# Altium schematic sheet QWIIC.SchDoc: QWIIC
size A3; Author: Silvio Navaretti; CompanyName: ARDUINO; DrawnBy: Silvio Navaretti; Engineer: Silvio Navaretti; Organization: ARDUINO; SheetNumber: 13; SheetTotal: 51; RevAuthor: Silvio Navaretti
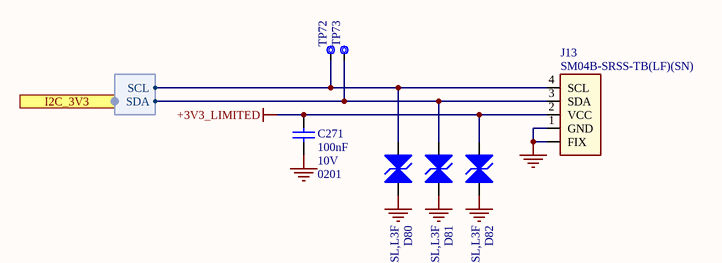
[diagram p0: QWIIC.SchDoc]

## Parts
C271  value 100nF  Voltage: 10V  Case Code (Imperial): 0201  [CAP-0201]  (hidden comment: CL03A104KP3NNNC)
D80  DF2B7ASL,L3F  [DF2B7ASL,L3F]
D81  DF2B7ASL,L3F  [DF2B7ASL,L3F]
D82  DF2B7ASL,L3F  [DF2B7ASL,L3F]
J13  SM04B-SRSS-TB(LF)(SN)  [SM04B-SRSS-TB(LF)(SN)-Footprint-1]
TP72  Test point 1.00mm  [TP-1.00MM]  (value not drawn)  (no BOM)
TP73  Test point 1.00mm  [TP-1.00MM]  (value not drawn)  (no BOM)

## Ports
I2C_3V3 (harness I2C)

## Harnesses
I2C: SDA, SCL

## Nets
+3V3_LIMITED: C271.2 D82.2(A2) J13.2(VCC)
GND: C271.1 D80.1(A1) D81.1(A1) D82.1(A1) J13.1(GND) J13.FIX
NetD80_2: D80.2(A2) J13.4(SCL) TP72.X ; port I2C_3V3.SCL
NetD81_2: D81.2(A2) J13.3(SDA) TP73.X ; port I2C_3V3.SDA

## Notes on the sheet
- Title:
- ID:
- Date:
- Time:
- Version:
- Sheet
- of
- RevAuthor:
- Reference Designs ARE PROVIDED "AS IS" AND "WITH ALL FAULTS. Arduino SA DISCLAIMS ALL OTHER WARRANTIES, EXPRESS OR IMPLIED, REGARDING PRODUCTS, INCLUDING BUT NOT LIMITED TO, ANY IMPLIED WARRANTIES OF MERCHANTABILITY OR FITNESS FOR A PARTICULAR PURPOSE.
  Arduino SA may make changes to specifications and product descriptions at any time, without notice. The Customer must not rely on the absence or characteristics of any features or instructions marked "reserved" or "undefined".
  Arduino SA reserves these for future definition and shall have no responsibility whatsoever for conflicts or incompatibilities arising from future changes to them. The product information on the Web Site or Materials is subject to change without notice.
  Do not finalize a design with this info. ARDUINO and other Arduino brands and logos and Trademarks of Arduino SA. All Arduino SA Trademarks cannot be used without owner's formal permission.
- File:
- Author:

## Library data of the parts
C271 = C0113-A.6: CAP CHIP 0201 100nF 10% 10V X5R; Manufacturer: Samsung Electro-Mechanics; Code Arduino: C0113; Technology: Ceramic; Part Number: CL03A104KP3NNNC; Dielectric: X5R; Tolerance: 10%
D80-D82 = D0099-5: TVS BIDIRECTIONAL SMD Vr 5.5V, Vbr min 5.8V, 0.62x0.32mm; Manufacturer: TOSHIBA; Vforward max: 0V; Ireverse max: 1µA; Power max: 80W; Code Arduino: D0099; Vreverse max: 20V; V(BR) min: 5.8V; V(RWM) max: 5.5V; Part Number: DF2B7ASL,L3F
J13 = J0005-A.3: CONN JST SH 1mm 4POS HORIZONTAL TIN QWIIC; Code Arduino: J0005; Manufacturer: JST; Part Number: SM04B-SRSS-TB(LF)(SN); LCSC Part #: C160404
TP72 TP73 = UT0013-A.6: Part Number: This is not a component; Design Item ID: CMP-018-0005-A.3; Source: ut.SchLib; Manufacturer: This is not a component; Code Arduino: This is not a component; Pin Count: 1